# Altium schematic sheet SCH_WINGLET_SD_MMC.SchDoc: Winglet MicroSD & eMMC
size B; DrawnBy: HCAdam; Organization: Aerospace Village; DocumentNumber: WINGLET; Revision: A; SheetNumber: 4; SheetTotal: 10
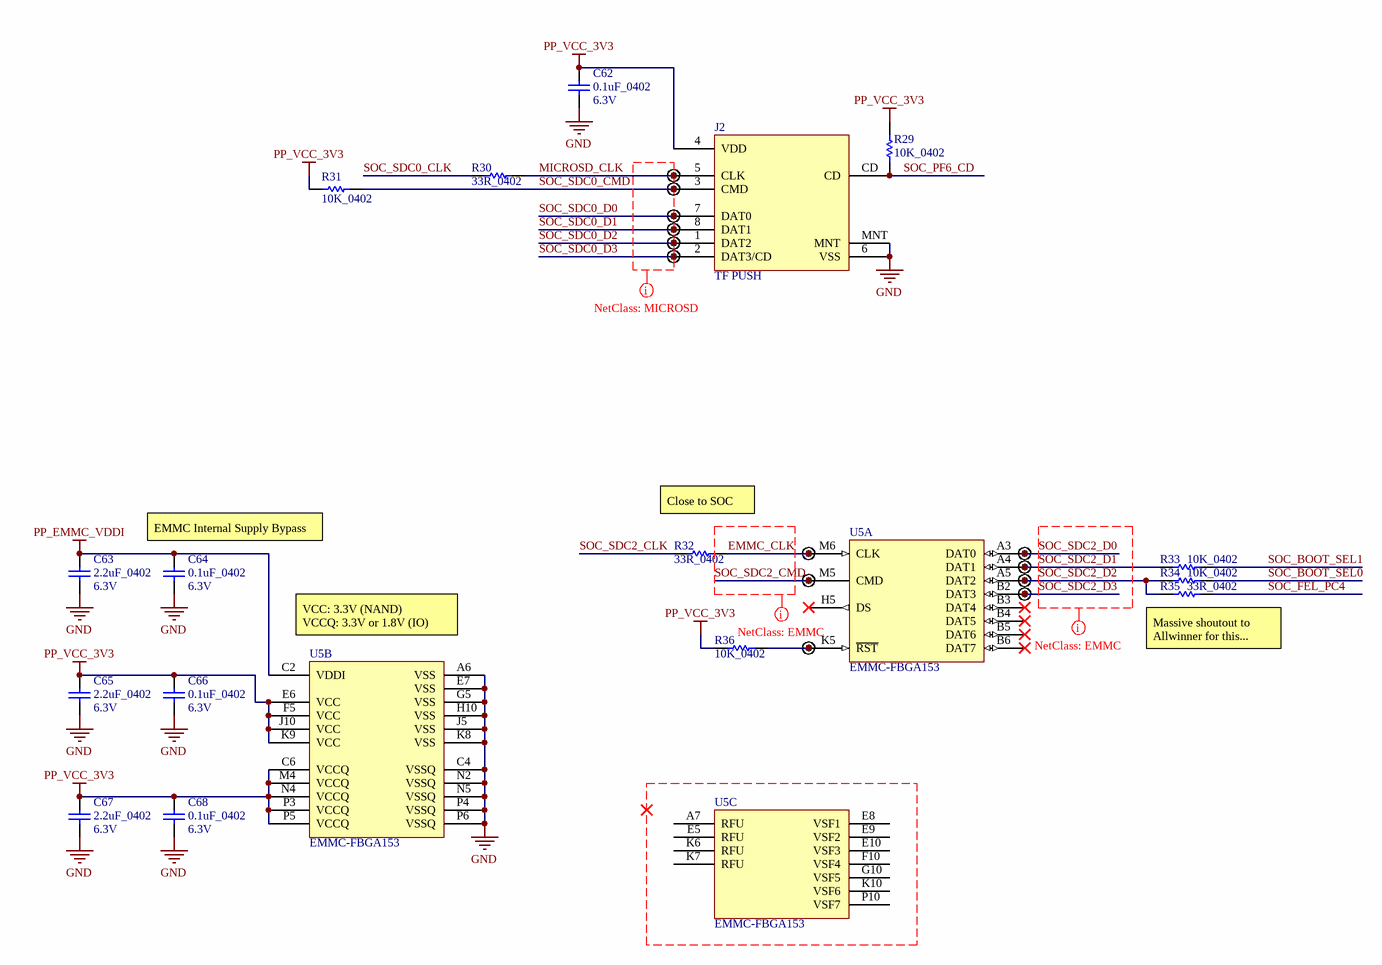
[diagram p0: SCH_WINGLET_SD_MMC.SchDoc]

## Parts
C62  0.1uF_0402  Voltage Rating: 6.3V  [CAPC1005X56X25NL10T15]
C63  2.2uF_0402  Voltage Rating: 6.3V  [CAPC1005X55X25NL05T10]
C64  0.1uF_0402  Voltage Rating: 6.3V  [CAPC1005X56X25NL10T15]
C65  2.2uF_0402  Voltage Rating: 6.3V  [CAPC1005X55X25NL05T10]
C66  0.1uF_0402  Voltage Rating: 6.3V  [CAPC1005X56X25NL10T15]
C67  2.2uF_0402  Voltage Rating: 6.3V  [CAPC1005X55X25NL05T10]
C68  0.1uF_0402  Voltage Rating: 6.3V  [CAPC1005X56X25NL10T15]
J2  TF PUSH  [LCSC_TF_PUSH]
R29  10K_0402  [RESC1005X40X25NL05T05]
R30  33R_0402  [RESC1005X40X25NL05T05]
R31  10K_0402  [RESC1005X40X25NL05T05]
R32  33R_0402  [RESC1005X40X25NL05T05]
R33  10K_0402  [RESC1005X40X25NL05T05]
R34  10K_0402  [RESC1005X40X25NL05T05]
R35  33R_0402  [RESC1005X40X25NL05T05]
R36  10K_0402  [RESC1005X40X25NL05T05]
TP12  TESTPOINT  [TESTPOINT-0.7MM-SINGLE-LAYER]  (value not drawn)  (no BOM)
TP13  TESTPOINT  [TESTPOINT-0.7MM-SINGLE-LAYER]  (value not drawn)  (no BOM)
TP14  TESTPOINT  [TESTPOINT-0.7MM-SINGLE-LAYER]  (value not drawn)  (no BOM)
TP15  TESTPOINT  [TESTPOINT-0.7MM-SINGLE-LAYER]  (value not drawn)  (no BOM)
TP16  TESTPOINT  [TESTPOINT-0.7MM-SINGLE-LAYER]  (value not drawn)  (no BOM)
TP17  TESTPOINT  [TESTPOINT-0.7MM-SINGLE-LAYER]  (value not drawn)  (no BOM)
TP18  TESTPOINT  [TESTPOINT-0.7MM-SINGLE-LAYER]  (value not drawn)  (no BOM)
TP19  TESTPOINT  [TESTPOINT-0.7MM-SINGLE-LAYER]  (value not drawn)  (no BOM)
TP20  TESTPOINT  [TESTPOINT-0.7MM-SINGLE-LAYER]  (value not drawn)  (no BOM)
TP21  TESTPOINT  [TESTPOINT-0.7MM-SINGLE-LAYER]  (value not drawn)  (no BOM)
TP22  TESTPOINT  [TESTPOINT-0.7MM-SINGLE-LAYER]  (value not drawn)  (no BOM)
TP23  TESTPOINT  [TESTPOINT-0.7MM-SINGLE-LAYER]  (value not drawn)  (no BOM)
TP24  TESTPOINT  [TESTPOINT-0.7MM-SINGLE-LAYER]  (value not drawn)  (no BOM)
U5  EMMC-FBGA153  [BGA153C50P14X14_1150X1300X100]  (parts A,B,C of 3)

## Nets
GND: C62.1 C63.1 C64.1 C65.1 C66.1 C67.1 C68.1 J2.6(VSS) J2.MNT U5.A6(VSS) U5.C4(VSSQ) U5.E7(VSS) U5.G5(VSS) U5.H10(VSS) U5.J5(VSS) U5.K8(VSS) U5.N2(VSSQ) U5.N5(VSSQ) U5.P4(VSSQ) U5.P6(VSSQ)
PP_EMMC_VDDI: C63.2 C64.2 U5.C2(VDDI)
PP_VCC_3V3: C62.2 C65.2 C66.2 C67.2 C68.2 J2.4(VDD) R29.1 R31.1 R36.2 U5.C6(VCCQ) U5.E6(VCC) U5.F5(VCC) U5.J10(VCC) U5.K9(VCC) U5.M4(VCCQ) U5.N4(VCCQ) U5.P3(VCCQ) U5.P5(VCCQ)
EMMC_CLK: R32.2 TP18.1 U5.M6(CLK)
MICROSD_CLK: J2.5(CLK) R30.2 TP12.1
SOC_BOOT_SEL0: R34.2
SOC_BOOT_SEL1: R33.2
SOC_FEL_PC4: R35.2
SOC_PF6_CD: J2.CD R29.2
SOC_SDC0_CLK: R30.1
SOC_SDC0_CMD: J2.3(CMD) R31.2 TP13.1
SOC_SDC0_D0: J2.7(DAT0) TP14.1
SOC_SDC0_D1: J2.8(DAT1) TP15.1
SOC_SDC0_D2: J2.1(DAT2) TP16.1
SOC_SDC0_D3: J2.2(DAT3/CD) TP17.1
SOC_SDC2_CLK: R32.1
SOC_SDC2_CMD: TP21.1 U5.M5(CMD)
SOC_SDC2_D0: TP19.1 U5.A3(DAT0)
SOC_SDC2_D1: R33.1 TP20.1 U5.A4(DAT1)
SOC_SDC2_D2: R34.1 R35.1 TP22.1 U5.A5(DAT2)
SOC_SDC2_D3: TP23.1 U5.B2(DAT3)
NetR36_1: R36.1 TP24.1 U5.K5(~{RST})

Not connected (* = marked no-connect by the designer): U5 A7(RFU) B3(DAT4)* B4(DAT5)* B5(DAT6)* B6(DAT7)* E5(RFU) E8(VSF1) E9(VSF2) E10(VSF3) F10(VSF4) G10(VSF5) H5(DS)* K6(RFU) K7(RFU) K10(VSF6) P10(VSF7)

## Layout directives
net class MICROSD: (no net found under the mark)
net class EMMC: EMMC_CLK, SOC_SDC2_CMD, SOC_SDC2_D0, SOC_SDC2_D1, SOC_SDC2_D2, SOC_SDC2_D3

## Notes on the sheet
- (near C64) EMMC Internal Supply Bypass
- (near R32) Close to SOC
- (near U5) VCC: 3.3V (NAND)
  VCCQ: 3.3V or 1.8V (IO)
- (near R35) Massive shoutout to Allwinner for this...
- Title
- Size:
- Date:
- B
- Project:
- Revision:
- Sheet
- of
- Drawn By:

## Library data of the parts
C62 C64 C66 C68 = CMP-2008-02743-1: 04026D104KAT2A; Manufacturer: AVX Interconnect / Elco; Part Number: 04026D104KAT2A
C63 C65 C67 = CMP-2008-04543-1: GRM155R60J225ME15D; Manufacturer: Murata; Part Number: GRM155R60J225ME15D
J2 = SDCARD_TF_PUSH: MicroSD Card Slot Push-Pull
R29 R31 R33 R34 R36 = CMP-2000-07588-1: Chip Resistor, 10 KOhm, +/- 1%, 0.1 W, -55 to 155 degC, 0402 (1005 Metric), RoHS, Tape and Reel / ERJ2RKF1002X; Manufacturer: Panasonic; Power Rating: 100mW; Voltage Rating: 50V; Resistance: 10KOhm; Case\/Package: 0402; Temperature Coefficient: 100ppm\/degreesC; RoHSCompliant: True; Lead Free: LeadFree; Package Quantity: 1; Contact Plating: Tin; Length: 1mm; Radiation Hardening: No; REACH SVHC: NoSVHC; Max Operating Temperature: 155degC; Depth: 0.5mm; Case Code (Imperial): 0402; Military Standard: Not; Package Description: 2-Pin Surface Mount Device, Body 1 x 0.5 mm; Termination: SMD/SMT; Case Code (Metric): 1005; Height: 0.35mm; Packaging: TapeandReel; Voltage Rating (DC): 50V; Package Reference: 402; Number of Pins: 2; Tolerance: 1%; Mounting Technology: SurfaceMount; Width: 0.02inch; Mount: SurfaceMount; Datasheet URL: https://industrial.panasonic.com/cdbs/www-data/pdf/RDA0000/AOA0000C304.pdf; Composition: ThickFilm; Datasheet Version: 02/2017; Manufacturer URL: http://www.panasonic.com/; Max Power Dissipation: 100mW; Number of Terminations: 2; Min Operating Temperature: -55degC
R30 R32 R35 = CMP-2002-01146-1: ERJ2RKF33R0X; Manufacturer: Panasonic; Part Number: ERJ2RKF33R0X
TP12-TP24 = TP_07: TESTPOINT SINGLE LAYER 0.7MM; AEC-Q: Yes; PPAP: Unknown; Selective Soldering: No; Value: Unknown; RoHS: Yes; Package: BOARD_FEATURE; Washable: Yes; Mounting: Unknown
U5 = EMMC-FBGA153: FLASH - NAND (MLC) Memory IC 32Gb (4G x 8) eMMC 5.1 153-FBGA (11.5x13)